# Altium schematic sheet Sheet1.SchDoc
size A4; SheetNumber: 16; SheetTotal: 16
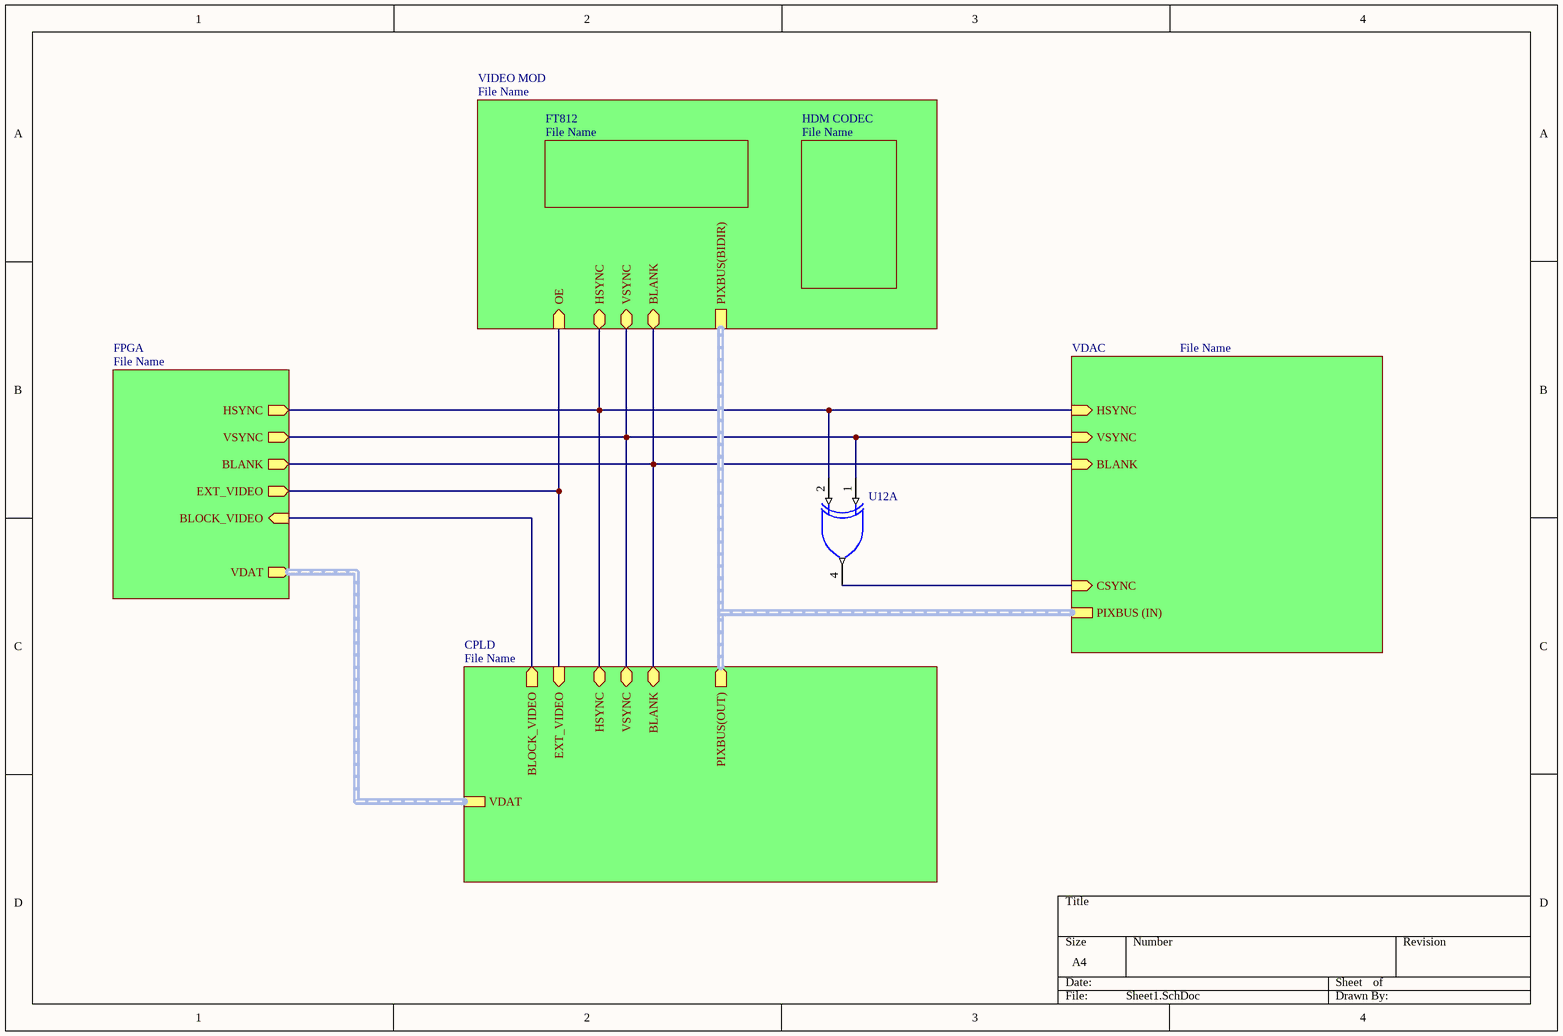
[diagram p0: Sheet1.SchDoc]

## Parts
U12  SN74AHCT1G86DBVR  [DBV0005A_L]  (value not drawn)  (part A of 2)

## Sub-sheets
CPLD = File Name: HSYNC (bidir), VSYNC (bidir), BLANK (bidir), EXT_VIDEO (in), VDAT, PIXBUS(OUT) (out, harness SPI), BLOCK_VIDEO (out)
FPGA = File Name: HSYNC (out), VSYNC (out), BLANK (out), EXT_VIDEO (out), VDAT (out), BLOCK_VIDEO (in)
FT812 = File Name: no entries
HDM CODEC = File Name: no entries
VDAC = File Name: HSYNC (in), VSYNC (in), BLANK (in), CSYNC (in), PIXBUS (IN)
VIDEO MOD = File Name: HSYNC (bidir), VSYNC (bidir), BLANK (bidir), OE (in), PIXBUS(BIDIR)

## Nets
NetU12_1: U12.1(A) ; sheet FPGA/VSYNC, sheet VIDEO MOD/VSYNC, sheet CPLD/VSYNC, sheet VDAC/VSYNC
NetU12_2: U12.2(B) ; sheet FPGA/HSYNC, sheet VIDEO MOD/HSYNC, sheet CPLD/HSYNC, sheet VDAC/HSYNC
NetU12_4: U12.4(Y) ; sheet VDAC/CSYNC
(unnamed): sheet FPGA/BLANK, sheet VIDEO MOD/BLANK, sheet CPLD/BLANK, sheet VDAC/BLANK
(unnamed): sheet FPGA/EXT_VIDEO, sheet VIDEO MOD/OE, sheet CPLD/EXT_VIDEO
(unnamed): sheet FPGA/BLOCK_VIDEO, sheet CPLD/BLOCK_VIDEO

## Buses and harness runs
harness sheet CPLD/PIXBUS(OUT) = sheet VDAC/PIXBUS (IN) = sheet VIDEO MOD/PIXBUS(BIDIR)
harness sheet CPLD/VDAT = sheet FPGA/VDAT

## Library data of the parts
U12 = CMP-0859-00100-3: Single 2-Input Exclusive-OR Gate, DBV0005A, LARGE T&R; Manufacturer: Texas Instruments; VCC(Max)(V): 5.5; ICC @ Nom Voltage(Max)(mA): 0.01; Gate Type: XOR; Schmitt Trigger: No; tpd @ Nom Voltage(Max)(ns): 8; Voltage(Nom)(V): 5; Logic: True; Input Type: CMOS; F @ Nom Voltage(Max)(Mhz): 75; Output Drive (IOL/IOH)(Max)(mA): 8/-8; Sub-Family: XOR Gate; Rating: Catalog; Bits(#): 1; VCC(Min)(V): 2; Technology Family: AHCT; DatasheetVersion: SCLS324M; Generic Part Number: SN74AHCT1G86; 3-State Output: No; Output Type: CMOS; Operating Temperature Range(C): -40 to 125; PackageReference: DBV0005A